# Altium schematic sheet Top Layer.SchDoc
size A
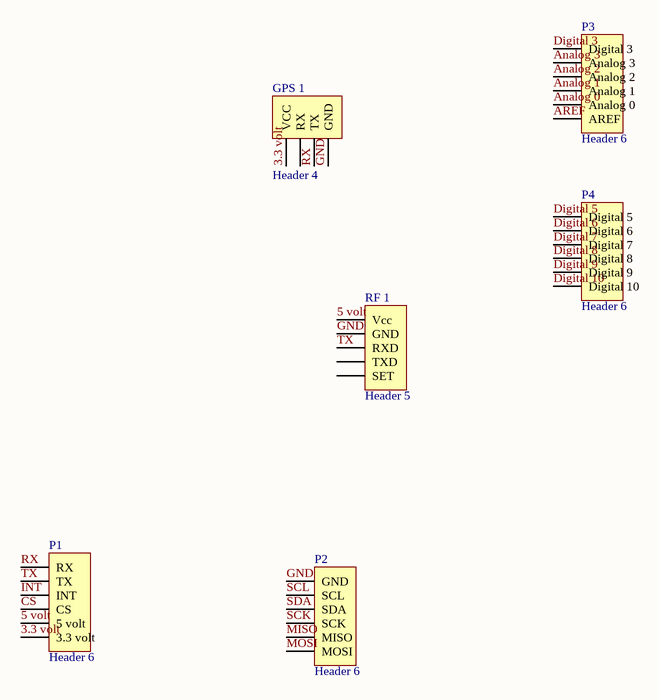
[diagram p0: Top Layer.SchDoc]

## Parts
GPS_1  Header 4  [HDR1X4]
P1  Header 6  [HDR1X6]
P2  Header 6  [HDR1X6]
P3  Header 6  [HDR1X6]
P4  Header 6  [HDR1X6]
RF_1  Header 5  [HDR1X5]

## Nets
3.3 volt: GPS_1.1(VCC) P1.6(3.3_volt)
5 volt: P1.5(5_volt) RF_1.1(Vcc)
Analog 0: P3.5(Analog_0)
Analog 1: P3.4(Analog_1)
Analog 2: P3.3(Analog_2)
Analog 3: P3.2(Analog_3)
AREF: P3.6(AREF)
CS: P1.4(CS)
Digital 3: P3.1(Digital_3)
Digital 5: P4.1(Digital_5)
Digital 6: P4.2(Digital_6)
Digital 7: P4.3(Digital_7)
Digital 8: P4.4(Digital_8)
Digital 9: P4.5(Digital_9)
Digital 10: P4.6(Digital_10)
GND: GPS_1.4(GND) P2.1(GND) RF_1.2(GND)
INT: P1.3(INT)
MISO: P2.5(MISO)
MOSI: P2.6(MOSI)
RX: GPS_1.3(TX) P1.1(RX)
SCK: P2.4(SCK)
SCL: P2.2(SCL)
SDA: P2.3(SDA)
TX: P1.2(TX) RF_1.3(RXD)

Not connected (* = marked no-connect by the designer): GPS_1 2(RX); RF_1 4(TXD) 5(SET)

## Library data of the parts
GPS_1 = Header 4: Header, 4-Pin; LatestRevisionDate: 17-Jul-2002; LatestRevisionNote: Re-released for DXP Platform.; Publisher: Altium Limited
P1-P4 = Header 6: Header, 6-Pin; LatestRevisionDate: 17-Jul-2002; LatestRevisionNote: Re-released for DXP Platform.; Publisher: Altium Limited
RF_1 = Header 5: Header, 5-Pin; LatestRevisionDate: 17-Jul-2002; LatestRevisionNote: Re-released for DXP Platform.; Publisher: Altium Limited